# EAGLE design TempSensor (EAGLE 7.7.0)
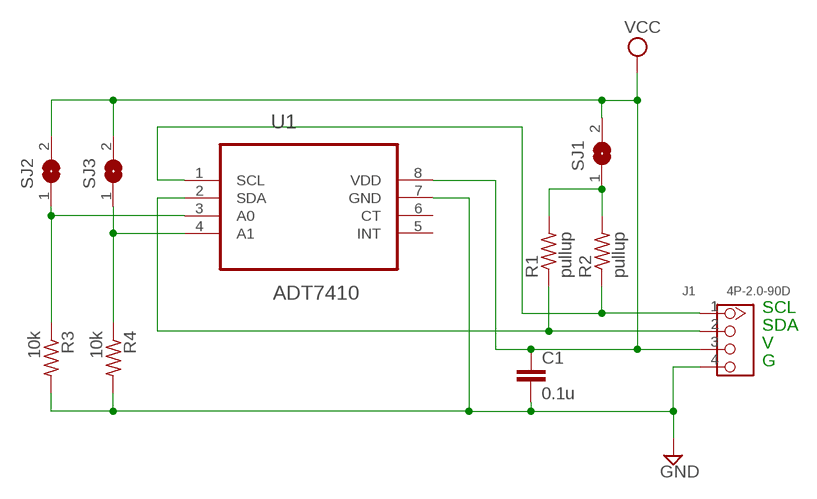
[diagram p0: schematic, sheet 1]

## Parts
C1  0.1u  C-EUC0603  [C0603]
J1  4P-2.0-90D  GROVE-CONNECTOR-DIP-90D(4P-2.0)  [HW4-2.0-90D]
R1  pullup  R-US_R0603  [R0603]
R2  pullup  R-US_R0603  [R0603]
R3  10k  R-US_R0603  [R0603]
R4  10k  R-US_R0603  [R0603]
SJ1  SJ  [SJ]
SJ2  SJ  [SJ]
SJ3  SJ  [SJ]
U1  ADT7410  [SOIC127P600X175-8N]

## Nets
GND: C1.2 J1.4 R3.2 R4.2 U1.7(GND)
N$1: J1.1 R2.1 U1.1(SCL)
N$2: J1.2 R1.1 U1.2(SDA)
N$3: R1.2 R2.2 SJ1.1
N$4: R4.1 SJ3.1 U1.4(A1)
N$5: R3.1 SJ2.1 U1.3(A0)
VCC: C1.1 J1.3 SJ1.2 SJ2.2 SJ3.2 U1.8(VDD)
Unconnected: U1.5(INT) U1.6(CT)

## Notes on the sheet
- SCL
- SDA
- V
- G

## Library data of the parts
C1 = 0my:C-EU: CAPACITOR, European symbol
J1 = Seeed-OPL-Connector:GROVE-CONNECTOR-DIP-90D(4P-2.0): 320110034
R1-R4 = 0my:R-US_: RESISTOR, American symbol
SJ1-SJ3 = jumper:SJ: SMD solder JUMPER
U1 = 0-chirimen:ADT7410: 8-bit Microcontroller with In-System Programmable Flash; MPN: ATTINY13A-SSH; OC_FARNELL: 1715519; OC_NEWARK: 15R0301; PACKAGE: SOIC-8; SUPPLIER: Atmel

## Net classes
0 default: width 0.33 mm, drill 0.178 mm, clearance 0.152 mm
1 VCC: width 0.508 mm, drill 0.178 mm, clearance 0.152 mm
2 GND: width 0.508 mm, drill 0.178 mm, clearance 0.152 mm

## Board
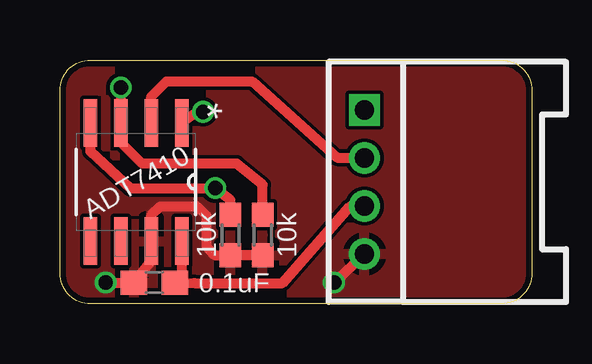
[diagram p1: board, top side]
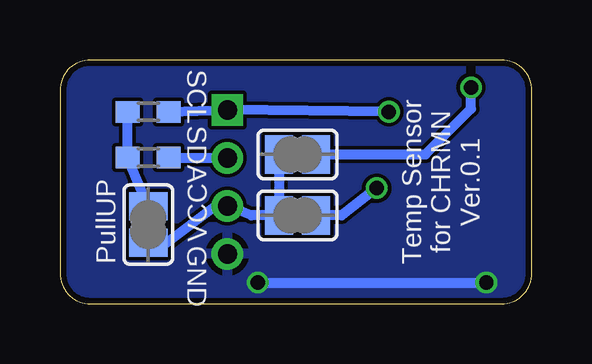
[diagram p2: board, bottom side, seen from below]

Size 19.68 x 10.16 mm. Coordinates in mm from the lower left corner, seen from the top.
Outline: 1.27,10.16 18.41,10.16 arc-90 19.68,8.89 19.68,1.27 arc-90 18.41,0 1.27,0 arc-90 0,1.27 0,8.89 arc-90 1.27,10.16
Copper layers (1*16): Top 0.035mm / dielectric 1.5mm / Bottom 0.035mm
Design rules "Elecrow_2-layer_eagle_rule": minimum track width 6mil, minimum drill 12mil, track to track 6mil, track to pad 6mil, pad to pad 6mil, via to via 6mil, smd to smd 0mil, copper to edge 10mil, drill to drill 10mil, minimum pad ring 10mil, minimum via ring 6mil, stop-mask expansion 2mil, vias tented up to drill 100mil, thermal gap 10mil

### Footprints (pad centres in the part's own frame; a part is rotated, then mirrored left to right if it is on the bottom)
C0603 = smd 1.1 x 1: 1 -0.85,0; 2 0.85,0
HW4-2.0-90D = drill 0.8 pad 1.27 square: 1 -3,0 | drill 0.8 pad 1.27: 2 -1,0; 3 1,0; 4 3,0
R0603 = smd 1 x 0.9: 1 -0.85,0; 2 0.85,0
SJ = smd 1.168 x 1.6: 1 -0.762,0; 2 0.762,0
SOIC127P600X175-8N = smd 1.981 x 0.559: 1 -2.464,1.905; 2 -2.464,0.635; 3 -2.464,-0.635; 4 -2.464,-1.905; 5 2.464,-1.905; 6 2.464,-0.635; 7 2.464,0.635; 8 2.464,1.905

### Placement (x,y rotation side)
C1  3.94,0.89 180 top
J1  12.7,5.08 270 top
R1  16,6.1 180 bottom
R2  16,8 180 bottom
R3  8.46,2.87 270 top
R4  7.11,2.87 270 top
SJ1  16,3.3 270 bottom
SJ2  9.78,6.22 180 bottom
SJ3  9.78,3.68 180 bottom
U1  3.17,5.08 270 top

### Tracks (layer width: path | path; a pad name or v marks a point on that pad's centre or on a via)
GND  (via drill 0.6)
  Top 0.406: R3.2 R4.2 6.45,2.03 6.1,2.41 6.1,3.68 5.71,4.06 4.19,4.06 3.81,3.68 U1.7 3.81,1.78 C1.2 v1.91,0.89 | J1.4 v11.43,0.89
  Bottom 0.406: v11.43,0.89 v1.91,0.89
  pour Bottom: -0.64,10.16 20.32,10.16 20.32,0 -0.64,0
  pour Top: -0.64,10.16 20.32,10.16 20.32,0 -0.64,0
N$1  (via drill 0.6)
  Top 0.406: U1.1 5.71,8 v5.97,8
  Bottom 0.406: R2.1 J1.1 v5.97,8
N$2
  Top 0.406: U1.2 3.81,8.64 4.45,9.27 8,9.27 11.56,6.1 J1.2
  Bottom 0.406: R1.1 J1.2
N$3
  Bottom 0.406: SJ1.1 R1.2 R2.2
N$4  (via drill 0.6)
  Top 0.406: U1.4 1.27,6.35 2.92,4.83 v6.48,4.83 7.11,4.32 R4.1
  Bottom 0.406: v6.48,4.83 7.92,3.68 SJ3.1
N$5  (via drill 0.6)
  Top 0.406: v2.54,9.02 U1.3 2.54,6.73 3.43,5.84 7.37,5.84 8.46,4.95 R3.1
  Bottom 0.406: SJ2.1 4.45,6.22 2.54,8.13 v2.54,9.02
VCC
  Top 0.406: C1.1 5.08,1.27 U1.8 5.08,0.89 5.61,0.86 9.27,0.86 12.1,4.07 J1.3
  Bottom 0.406: SJ1.2 15.24,2.54 13.21,4.06 J1.3 11.71,3.68 SJ3.2 SJ2.2

### Text on the board
tNames: ADT7410 | 10k | 10k | 0.1uF
bNames: SCL | SDA | Temp Sensor / for CHRMN / Ver.0.1 | VCC | PullUP | GND